# Altium schematic sheet Voltage Sensor.schdoc
size 286 x 144 mm
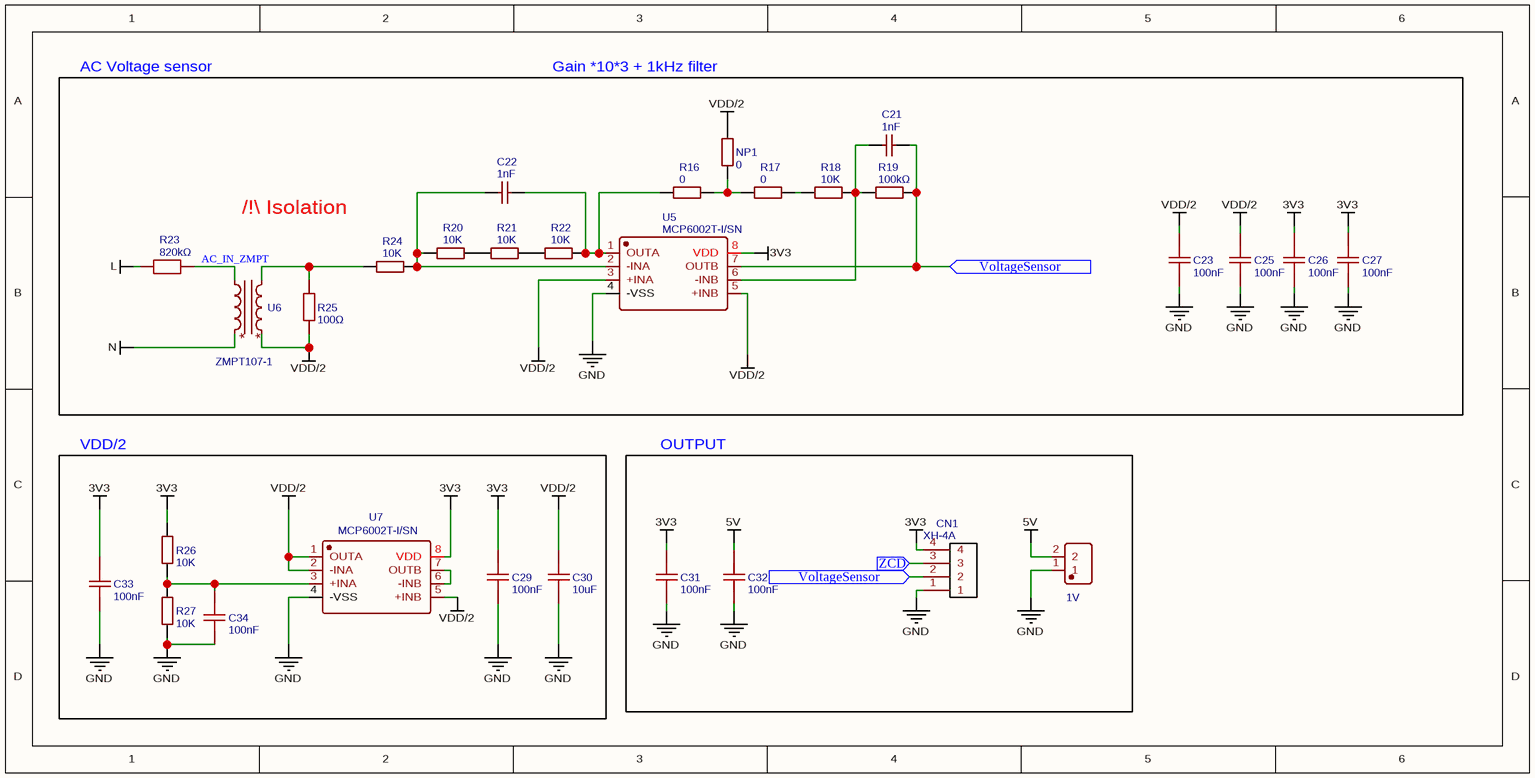
[diagram p0: Voltage Sensor.schdoc]

## Parts
1V  XH-2A_C2908600  [CONN-TH_2P-P2.50_HCTL_XH-2A-X]  (value not drawn)
C21  1nF  [C0603]
C22  1nF  [C0603]
C23  100nF  [C0603]
C25  100nF  [C0603]
C26  100nF  [C0603]
C27  100nF  [C0603]
C29  100nF  [C0603]
C30  10uF  [C0805]
C31  100nF  [C0603]
C32  100nF  [C0603]
C33  100nF  [C0603]
C34  100nF  [C0603]
CN1  XH-4A  [CONN-TH_4P-P2.50_XH-4A]
NP1  0  [R0603]
R16  0  [R0603]
R17  0  [R0603]
R18  10K  [R0603]
R19  100kΩ  [R0603]
R20  10K  [R0603]
R21  10K  [R0603]
R22  10K  [R0603]
R23  820kΩ  [R1206]
R24  10K  [R0603]
R25  100Ω  [R0603]
R26  10K  [R0603]
R27  10K  [R0603]
U5  MCP6002T-I/SN  [SOIC-8_L4.9-W3.9-P1.27-LS6.0-BL]
U6  ZMPT107-1  [XFMR-TH_ZMPT107-1]
U7  MCP6002T-I/SN  [SOIC-8_L4.9-W3.9-P1.27-LS6.0-BL]

## Blocks framed on the sheet
/!\ Isolation: C21-C23 C25-C27 NP1 R16-R25 U5 U6
VDD/2: C29 C30 C33 C34 R26 R27 U7
OUTPUT: 1V C31 C32 CN1

## Ports
VoltageSensor (in), ZCD (in)

## Nets
3V3: C26.1 C27.1 C29.1 C31.1 C33.1 CN1.4 R26.2 U5.8(VDD) U7.8(VDD)
5V: 1V.2 C32.1
GND: 1V.1 C23.2 C25.2 C26.2 C27.2 C29.2 C30.1 C31.2 C32.2 C33.2 C34.2 CN1.1 R27.1 U5.4(-VSS) U7.4(-VSS)
L: R23.1
N: U6.1
VDD/2: C23.1 C25.1 C30.2 NP1.2 R25.2 U5.3(+INA) U5.5(+INB) U6.3 U7.1(OUTA) U7.2(-INA) U7.5(+INB)
AC_IN_ZMPT: R23.2 U6.2
VoltageSensor: C21.2 CN1.2 R19.1 U5.7(OUTB) ; port VoltageSensor
ZCD: CN1.3 ; port ZCD
NetC21_1: C21.1 R18.2 R19.2 U5.6(-INB)
NetC22_1: C22.1 R20.1 R24.2 U5.2(-INA)
NetC22_2: C22.2 R16.1 R22.2 U5.1(OUTA)
NetC34_1: C34.1 R26.1 R27.2 U7.3(+INA)
NetNP1_1: NP1.1 R16.2 R17.1
NetR17_2: R17.2 R18.1
NetR20_2: R20.2 R21.1
NetR21_2: R21.2 R22.1
NetR24_1: R24.1 R25.1 U6.4
NetU7_6: U7.6(-INB) U7.7(OUTB)

## Notes on the sheet
- AC Voltage sensor
- Gain *10*3 + 1kHz filter

## Library data of the parts
1V = XH-2A_C2908600: BOM_Manufacturer: HCTL(华灿天禄); BOM_Manufacturer Part: XH-2A; Contributor: LCSC; BOM_Supplier: LCSC; BOM_Supplier Part: C2908600; BOM_JLCPCB Part Class: Extended Part; spicePre: C; spiceSymbolName: XH-2A_C2908600
C21 C22 = 1nF: BOM_Manufacturer Part: CL10B102KB8NNNC; BOM_Manufacturer: SAMSUNG; nameAlias: Capacitance; BOM_Supplier: LCSC; BOM_Supplier Part: C1588; BOM_JLCPCB Part Class: Basic Part; spicePre: C; spiceSymbolName: CL10B102KB8NNNC
C23 C25-C27 C29 C31-C34 = 100nF: BOM_Manufacturer: SAMSUNG; BOM_Manufacturer Part: CL10B104KB8NNNC; nameAlias: Capacitance; BOM_Supplier: LCSC; BOM_Supplier Part: C1591; BOM_JLCPCB Part Class: Extended Part; spicePre: C; spiceSymbolName: CL10B104KB8NNNC
C30 = 10uF: BOM_Manufacturer: FH; BOM_Manufacturer Part: 0805F106M160NT; nameAlias: Capacitance; BOM_Supplier: LCSC; BOM_Supplier Part: C90545; BOM_JLCPCB Part Class: Extended Part; spicePre: C; spiceSymbolName: 0805F106M160NT
CN1 = XH-4A: BOM_Manufacturer: BOOMELE; BOM_Supplier: LCSC; BOM_Manufacturer Part: XH-4A; BOM_Supplier Part: C37815; BOM_JLCPCB Part Class: Extended Part; spicePre: C; spiceSymbolName: XH-4A
NP1 R16 R17 = 0: BOM_Manufacturer: YAGEO; BOM_Manufacturer Part: RC0603JR-070RL; nameAlias: Resistance (Ohms); Resistance: 0Ω; BOM_Supplier: LCSC; BOM_Supplier Part: C95177; BOM_JLCPCB Part Class: Extended Part; spicePre: R; spiceSymbolName: RC0603JR-070RL
R18 R20-R22 R24 R26 R27 = 10K: BOM_Manufacturer: YAGEO; BOM_Manufacturer Part: RC0603FR-0710KL; nameAlias: Resistance (Ohms); Resistance: 10kΩ; BOM_Supplier: LCSC; BOM_Supplier Part: C98220; BOM_JLCPCB Part Class: Extended Part; spicePre: R; spiceSymbolName: RC0603FR-0710KL
R19 = 100kΩ: BOM_Manufacturer: RALEC; BOM_Manufacturer Part: RTT031003FTP; nameAlias: Resistance; Resistance (Ohms): 100K; BOM_Supplier: LCSC; BOM_Supplier Part: C103200; BOM_JLCPCB Part Class: Extended Part; spicePre: R; spiceSymbolName: RTT031003FTP
R23 = 820kΩ: BOM_Manufacturer: UNI-ROYAL(Uniroyal Elec); BOM_Manufacturer Part: HV06W4F8203T5E; Resistance (Ohms): 820K; nameAlias: Resistance; Contributor: LCSC; BOM_Supplier: LCSC; BOM_Supplier Part: C414773; BOM_JLCPCB Part Class: Extended Part; spicePre: R; spiceSymbolName: HV06W4F8203T5E
R25 = 100Ω: BOM_Manufacturer: ResistorToday; BOM_Manufacturer Part: AECR0603F100RK9; Resistance (Ohms): 100; nameAlias: Resistance; Contributor: LCSC; BOM_Supplier: LCSC; BOM_Supplier Part: C328334; BOM_JLCPCB Part Class: Extended Part; spicePre: R; spiceSymbolName: AECR0603F100RK9
U5 U7 = MCP6002T-I/SN: BOM_Manufacturer: MICROCHIP; BOM_Supplier: LCSC; BOM_Manufacturer Part: MCP6002T-I/SN; BOM_Supplier Part: C7377; BOM_JLCPCB Part Class: Basic Part; spicePre: U; spiceSymbolName: MCP6002T-I/SN
U6 = ZMPT107-1: BOM_Manufacturer: 择明朗熙; BOM_Supplier: LCSC; BOM_Manufacturer Part: ZMPT107-1; BOM_Supplier Part: C125191; BOM_JLCPCB Part Class: Extended Part; spicePre: L; spiceSymbolName: ZMPT107-1